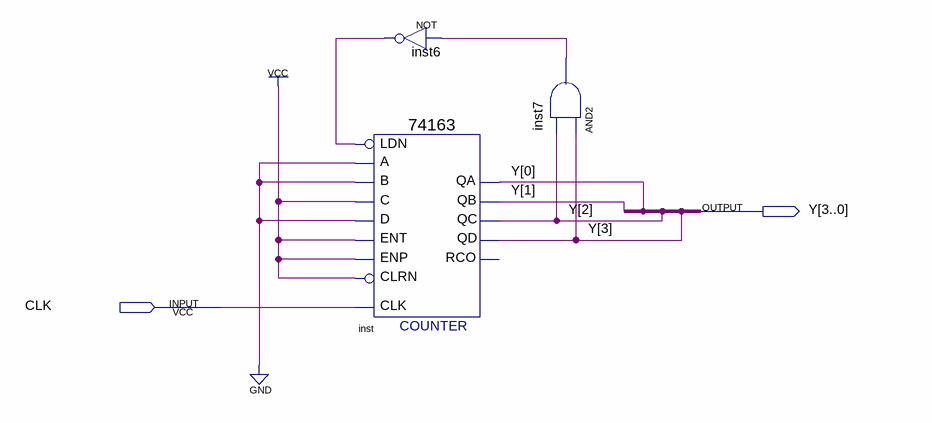
[diagram p0: schematic sheet]
// Quartus schematic SpecialCount4_12.bdf as structural Verilog: 3 symbols, 2 pins
module SpecialCount4_12 (
  input  CLK,
  output [3:0] Y
);

  wire inst6_out, inst7_out;

  \74163  inst (
    .C(1'b1), .B(1'b0), .A(1'b0), .ENT(1'b1), .D(1'b0), .CLRN(1'b1), .CLK(CLK), .ENP(1'b1), .LDN(inst6_out),
    .QA(Y[0]), .QB(Y[1]), .QC(Y[2]), .QD(Y[3]));  // open: RCO
  not inst6 (inst6_out, inst7_out);
  and inst7 (inst7_out, Y[3], Y[2]);
endmodule
